# EAGLE design level_shift (EAGLE 9.4.2)
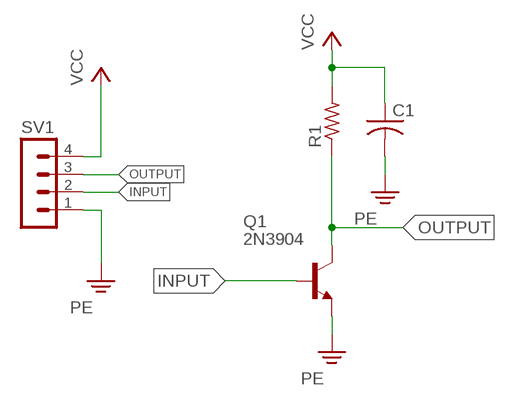
[diagram p0: schematic, sheet 1]

## Parts
C1  C-US025-030X050  [C025-030X050]
Q1  2N3904  [TO-92]
R1  R-US_0204/7  [0204/7]
SV1  MA04-1  [MA04-1]

## Nets
INPUT: Q1.B SV1.2
OUTPUT: Q1.C R1.1 SV1.3
PE: C1.2 Q1.E SV1.1
VCC: C1.1 R1.2 SV1.4

## Library data of the parts
C1 = rcl:C-US: CAPACITOR, American symbol; SPICEPREFIX: C
Q1 = transistors:2N3904
R1 = rcl:R-US_: RESISTOR, American symbol; SPICEPREFIX: R
SV1 = con-lstb:MA04-1: PIN HEADER; OC_FARNELL: unknown; OC_NEWARK: unknown

## Board
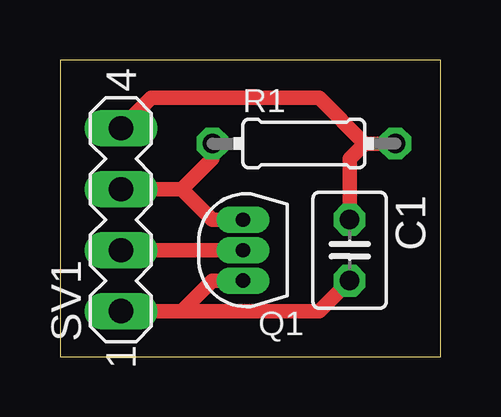
[diagram p1: board, top side]

Size 15.86 x 12.37 mm. Coordinates in mm from the lower left corner, seen from the top.
Outline: 0,0 15.86,0 15.86,12.37 0,12.37 0,0
Copper layers (1*16): Top 0.035mm / dielectric 1.5mm / Bottom 0.035mm
Design rules "default": minimum track width 6mil, minimum drill 0.35mm, track to track 6mil, track to pad 6mil, pad to pad 6mil, via to via 6mil, smd to smd 6mil, copper to edge 40mil, drill to drill 6mil, minimum pad ring 10mil, minimum via ring 8mil, stop-mask expansion 4mil, vias tented up to drill 0mil, thermal gap 10mil

### Footprints (pad centres in the part's own frame; a part is rotated, then mirrored left to right if it is on the bottom)
C025-030X050 = drill 0.813 octagon: 1 -1.27,0; 2 1.27,0
TO-92 = drill 0.6 pad 0.762 long: B 0,0; C 0,-1.27; E 0,1.27
0204/7 = drill 0.813 octagon: 1 -3.81,0; 2 3.81,0
MA04-1 = drill 1.016 long: 1 -3.81,0; 2 -1.27,0; 3 1.27,0; 4 3.81,0

### Placement (x,y rotation side)
C1  12.06,4.45 270 top
Q1  7.62,4.45 180 top
R1  10.16,8.89 0 top
SV1  2.54,5.71 90 top

### Tracks (layer width: path | path; a pad name or v marks a point on that pad's centre or on a via)
INPUT
  Top 0.61: SV1.2 Q1.B
OUTPUT
  Top 0.61: 5.08,6.99 SV1.3 3.17,6.99 | Q1.C 6.35,5.71 5.08,6.99 | R1.1 6.35,8.26 5.08,6.99
PE
  Top 0.61: SV1.1 5.08,1.91 | Q1.E 6.35,3.17 5.08,1.91 | 5.08,1.91 10.79,1.91 C1.2
VCC
  Top 0.152: C1.1 11.75,6.03
  Top 0.61: SV1.4 3.81,10.79 10.79,10.79 12.7,8.89 | R1.2 12.7,8.89 | 12.7,8.89 12.06,8.26 C1.1